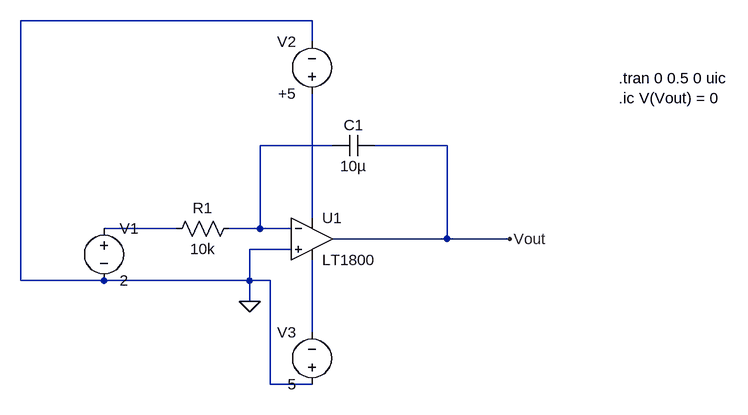
[diagram p0: schematic integrator_canonical.asc]
integrator_canonical.asc, the LTspice schematic file:
Version 4
SHEET 1 888 680
WIRE 160 -96 -288 -96
WIRE 160 -64 160 -96
WIRE 192 96 80 96
WIRE 368 96 256 96
WIRE 160 208 160 16
WIRE -48 224 -160 224
WIRE 80 224 80 96
WIRE 80 224 32 224
WIRE 128 224 80 224
WIRE 368 240 368 96
WIRE 368 240 192 240
WIRE 464 240 368 240
WIRE 128 256 64 256
WIRE -288 304 -288 -96
WIRE -160 304 -288 304
WIRE 64 304 64 256
WIRE 64 304 -160 304
WIRE 96 304 64 304
WIRE 64 336 64 304
WIRE 160 384 160 272
WIRE 96 464 96 304
WIRE 160 464 96 464
FLAG 64 336 0
FLAG 464 240 Vout
SYMBOL res 48 208 R90
WINDOW 0 0 56 VBottom 2
WINDOW 3 32 56 VTop 2
SYMATTR InstName R1
SYMATTR Value 10k
SYMBOL Opamps/LT1800 160 176 R0
SYMATTR InstName U1
SYMBOL cap 256 80 R90
WINDOW 0 0 32 VBottom 2
WINDOW 3 32 32 VTop 2
SYMATTR InstName C1
SYMATTR Value 10µ
SYMBOL voltage -160 208 R0
SYMATTR InstName V1
SYMATTR Value 2
SYMBOL voltage 160 32 R180
WINDOW 0 24 96 Left 2
WINDOW 3 24 16 Left 2
SYMATTR InstName V2
SYMATTR Value +5
SYMBOL voltage 160 480 R180
WINDOW 0 24 96 Left 2
WINDOW 3 24 16 Left 2
SYMATTR InstName V3
SYMATTR Value 5
TEXT 632 -8 Left 2 !.tran 0 0.5 0 uic\n.ic V(Vout) = 0

The netlist it stands for:
* integrator_canonical.asc
R1 N001 N003 10k
XU1 0 N001 N002 N004 Vout LT1800  ; pins In+ In- V+ V- OUT
C1 Vout N001 10µ
V1 N003 0 2
V2 N002 0 +5
V3 0 N004 5
.tran 0 0.5 0 uic
.ic V(Vout) = 0
.backanno
.end